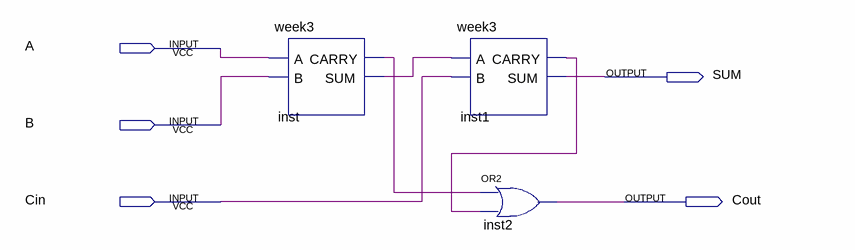
[diagram p0: schematic sheet]
// Quartus schematic FullAdder.bdf as structural Verilog: 3 symbols, 5 pins
module FullAdder (
  input  A,
  input  B,
  input  Cin,
  output SUM,
  output Cout
);

  wire inst1_carry, inst_carry, inst_sum;

  week3 inst (.A(A), .B(B), .CARRY(inst_carry), .SUM(inst_sum));
  week3 inst1 (.A(inst_sum), .B(Cin), .CARRY(inst1_carry), .SUM(SUM));
  or inst2 (Cout, inst_carry, inst1_carry);
endmodule
